# Altium schematic sheet SDRAM_32_BGA.SchDoc
size 420 x 297 mm; SheetNumber: 4; SheetTotal: 6; ListNumber: 2
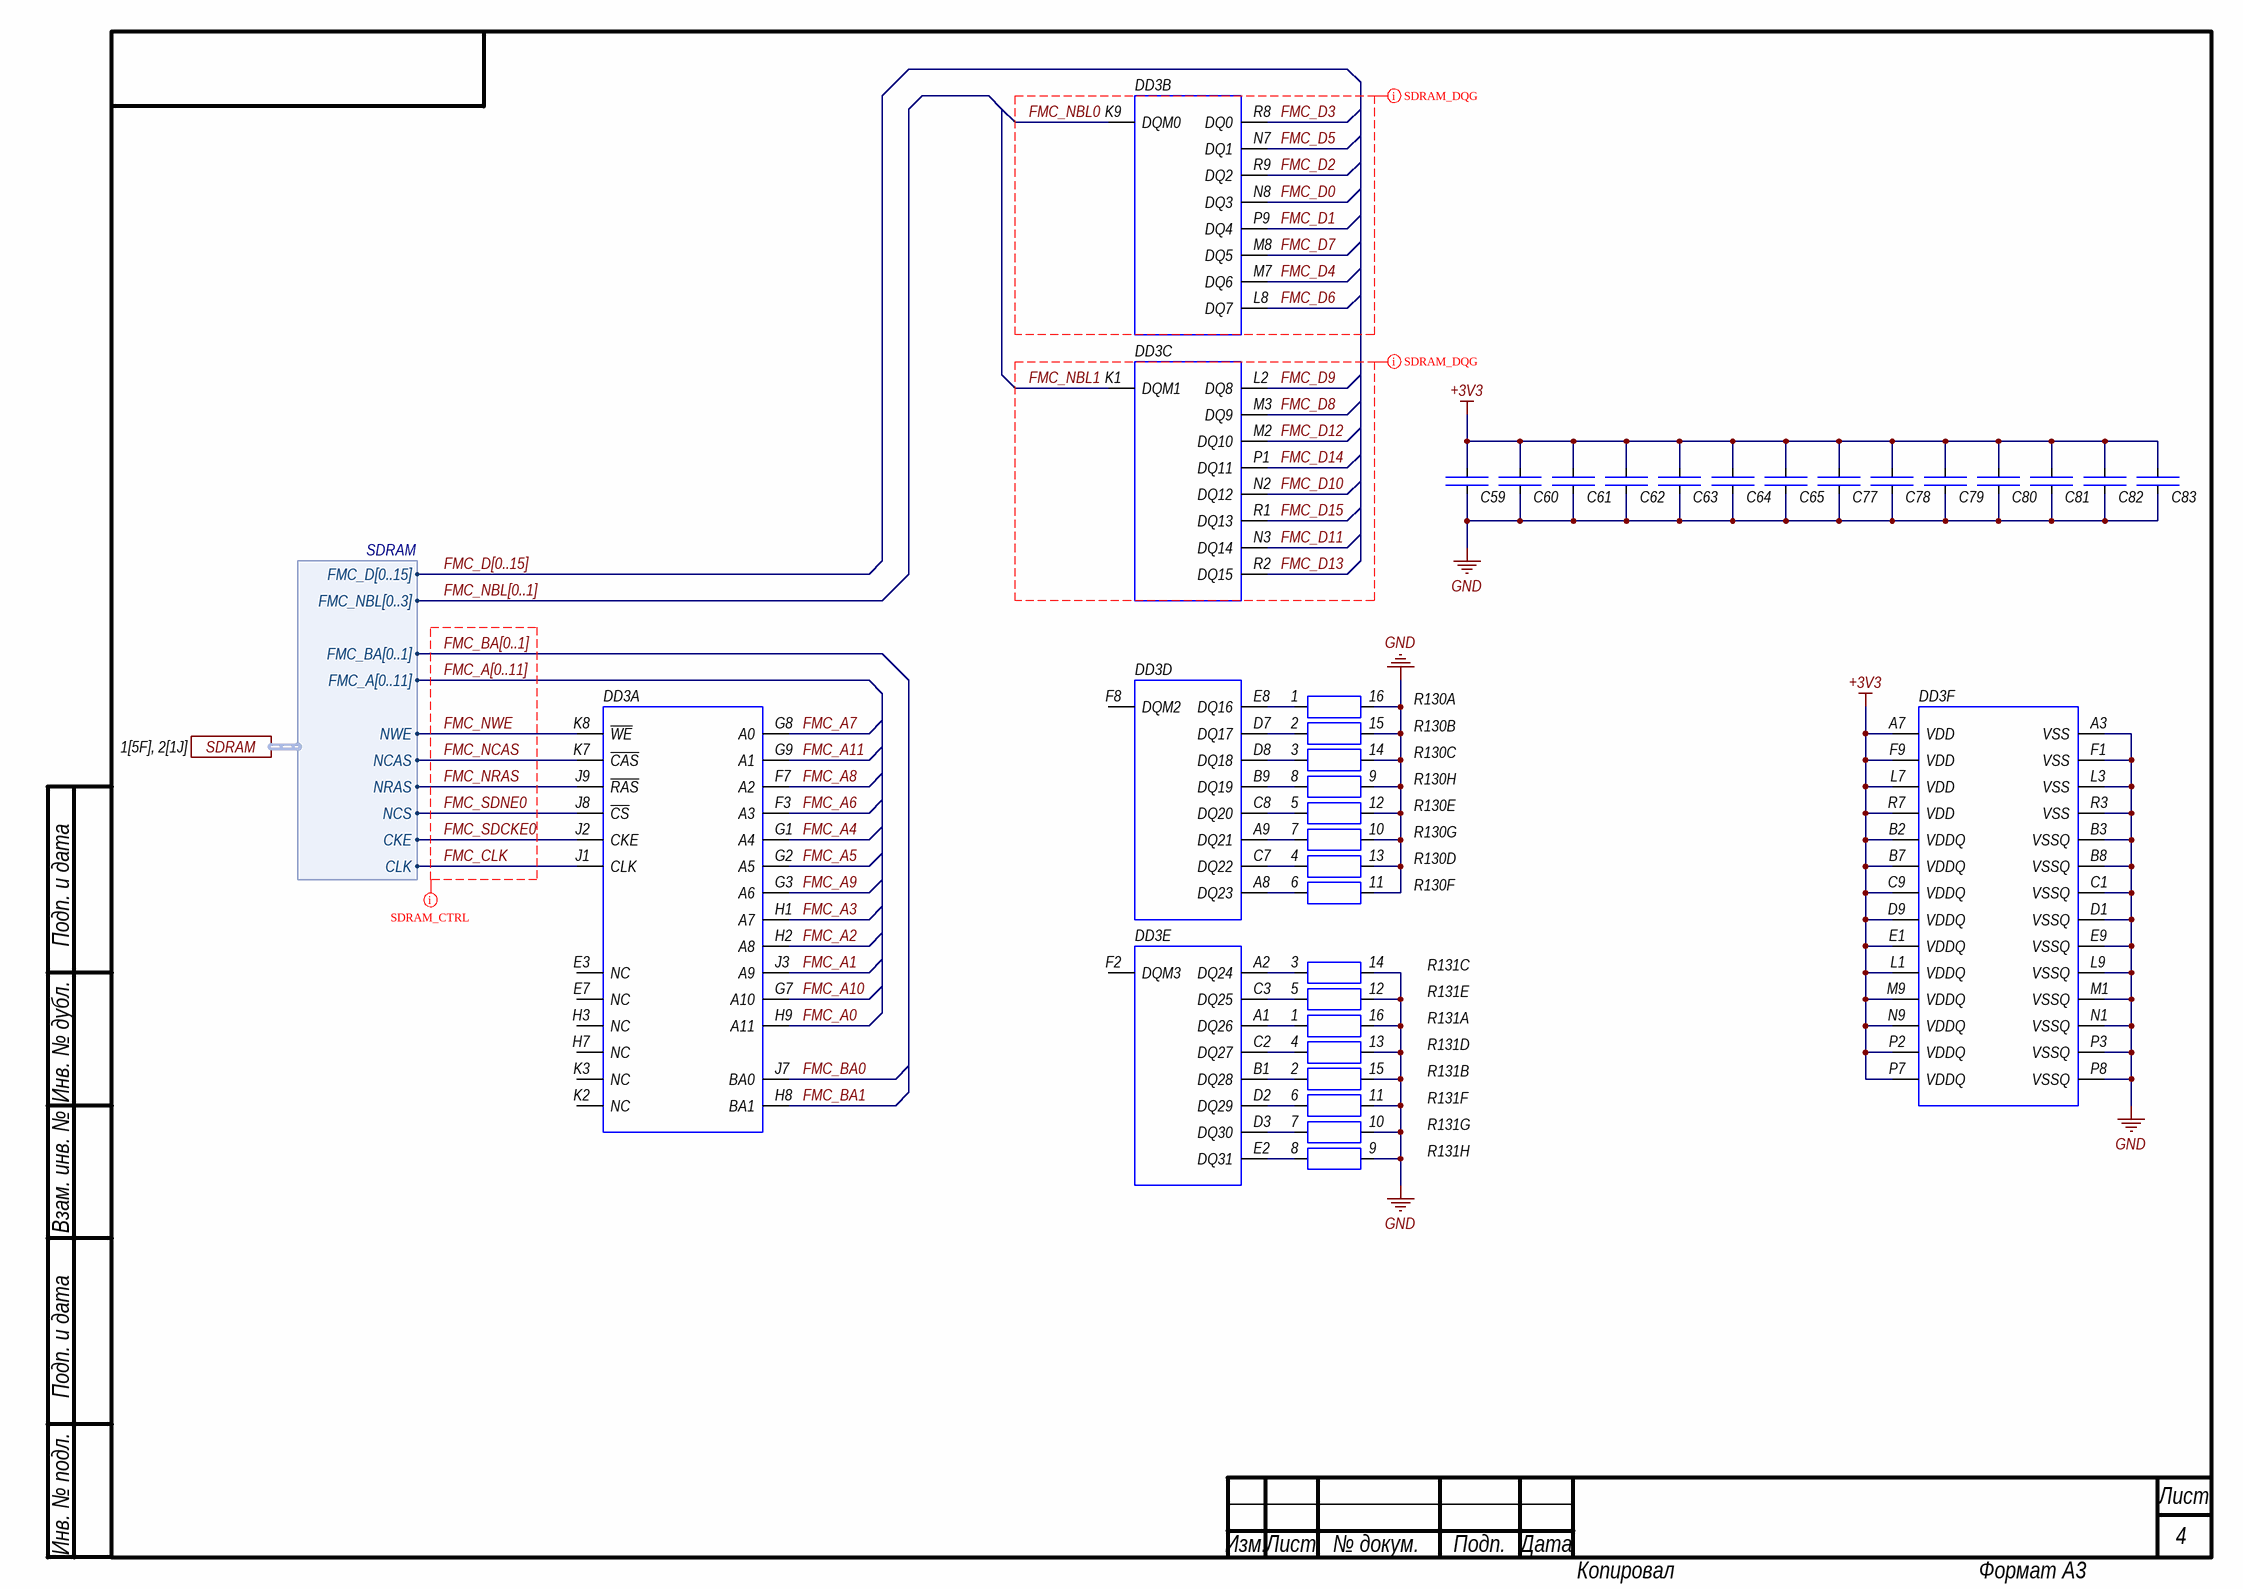
[diagram p0: SDRAM_32_BGA.SchDoc]

## Parts
C59  Конденсатор керам. ЧИП X5R, 10%, 0402, 0.1 мкФ  [Capacitor 0402]  (value not drawn)
C60  Конденсатор керам. ЧИП X5R, 10%, 0402, 0.1 мкФ  [Capacitor 0402]  (value not drawn)
C61  Конденсатор керам. ЧИП X5R, 10%, 0402, 0.1 мкФ  [Capacitor 0402]  (value not drawn)
C62  Конденсатор керам. ЧИП X5R, 10%, 0402, 0.1 мкФ  [Capacitor 0402]  (value not drawn)
C63  Конденсатор керам. ЧИП X5R, 10%, 0402, 0.1 мкФ  [Capacitor 0402]  (value not drawn)
C64  Конденсатор керам. ЧИП X5R, 10%, 0402, 0.1 мкФ  [Capacitor 0402]  (value not drawn)
C65  Конденсатор керам. ЧИП X5R, 10%, 0402, 0.1 мкФ  [Capacitor 0402]  (value not drawn)
C77  Конденсатор керам. ЧИП X5R, 10%, 0402, 0.1 мкФ  [Capacitor 0402]  (value not drawn)
C78  Конденсатор керам. ЧИП X5R, 10%, 0402, 0.1 мкФ  [Capacitor 0402]  (value not drawn)
C79  Конденсатор керам. ЧИП X5R, 10%, 0402, 0.1 мкФ  [Capacitor 0402]  (value not drawn)
C80  Конденсатор керам. ЧИП X5R, 10%, 0402, 0.1 мкФ  [Capacitor 0402]  (value not drawn)
C81  Конденсатор керам. ЧИП X5R, 10%, 0402, 0.1 мкФ  [Capacitor 0402]  (value not drawn)
C82  Конденсатор керам. ЧИП X5R, 10%, 0402, 0.1 мкФ  [Capacitor 0402]  (value not drawn)
C83  Конденсатор керам. ЧИП X5R, 10%, 0402, 0.1 мкФ  [Capacitor 0402]  (value not drawn)
DD3  Микросхема IS42S32400F-6BL  [BGA90C80P9X15_800X1300X120]  (value not drawn)  (parts A,B,C,D,E,F of 6)
R130  8-Resistor  [RESNET_1506-16_CONVEX]  (value not drawn)  (parts A,B,C,D,E,F,G,H of 8)
R131  8-Resistor  [RESNET_1506-16_CONVEX]  (value not drawn)  (parts A,B,C,D,E,F,G,H of 8)

## Ports
SDRAM (harness SDRAM, see 1[5F], 2[1J])

## Harnesses
SDRAM: FMC_D[0..15], NCAS, FMC_BA[0..1], NWE, FMC_A[0..11], NRAS, NCS, CLK, CKE, FMC_NBL[0..3]

## Nets
+3V3: C59.1 C60.1 C61.1 C62.1 C63.1 C64.1 C65.1 C77.1 C78.1 C79.1 C80.1 C81.1 C82.1 C83.1 DD3.A7(VDD) DD3.B2(VDDQ) DD3.B7(VDDQ) DD3.C9(VDDQ) DD3.D9(VDDQ) DD3.E1(VDDQ) DD3.F9(VDD) DD3.L1(VDDQ) DD3.L7(VDD) DD3.M9(VDDQ) DD3.N9(VDDQ) DD3.P2(VDDQ) DD3.P7(VDDQ) DD3.R7(VDD)
GND: C59.2 C60.2 C61.2 C62.2 C63.2 C64.2 C65.2 C77.2 C78.2 C79.2 C80.2 C81.2 C82.2 C83.2 DD3.A3(VSS) DD3.B3(VSSQ) DD3.B8(VSSQ) DD3.C1(VSSQ) DD3.D1(VSSQ) DD3.E9(VSSQ) DD3.F1(VSS) DD3.L3(VSS) DD3.L9(VSSQ) DD3.M1(VSSQ) DD3.N1(VSSQ) DD3.P3(VSSQ) DD3.P8(VSSQ) DD3.R3(VSS) R130.9 R130.10 R130.11 R130.12 R130.13 R130.14 R130.15 R130.16 R131.9 R131.10 R131.11 R131.12 R131.13 R131.14 R131.15 R131.16
FMC_A0: DD3.H9(A11)
FMC_A1: DD3.J3(A9)
FMC_A2: DD3.H2(A8)
FMC_A3: DD3.H1(A7)
FMC_A4: DD3.G1(A4)
FMC_A5: DD3.G2(A5)
FMC_A6: DD3.F3(A3)
FMC_A7: DD3.G8(A0)
FMC_A8: DD3.F7(A2)
FMC_A9: DD3.G3(A6)
FMC_A10: DD3.G7(A10)
FMC_A11: DD3.G9(A1)
FMC_BA0: DD3.J7(BA0)
FMC_BA1: DD3.H8(BA1)
FMC_CLK: DD3.J1(CLK) ; port SDRAM.CLK
FMC_D0: DD3.N8(DQ3)
FMC_D1: DD3.P9(DQ4)
FMC_D2: DD3.R9(DQ2)
FMC_D3: DD3.R8(DQ0)
FMC_D4: DD3.M7(DQ6)
FMC_D5: DD3.N7(DQ1)
FMC_D6: DD3.L8(DQ7)
FMC_D7: DD3.M8(DQ5)
FMC_D8: DD3.M3(DQ9)
FMC_D9: DD3.L2(DQ8)
FMC_D10: DD3.N2(DQ12)
FMC_D11: DD3.N3(DQ14)
FMC_D12: DD3.M2(DQ10)
FMC_D13: DD3.R2(DQ15)
FMC_D14: DD3.P1(DQ11)
FMC_D15: DD3.R1(DQ13)
FMC_NBL0: DD3.K9(DQM0)
FMC_NBL1: DD3.K1(DQM1)
FMC_NCAS: DD3.K7(~{CAS}) ; port SDRAM.NCAS
FMC_NRAS: DD3.J9(~{RAS}) ; port SDRAM.NRAS
FMC_NWE: DD3.K8(~{WE}) ; port SDRAM.NWE
FMC_SDCKE0: DD3.J2(CKE) ; port SDRAM.CKE
FMC_SDNE0: DD3.J8(~{CS}) ; port SDRAM.NCS
NetDD3_A1: DD3.A1(DQ26) R131.1
NetDD3_A2: DD3.A2(DQ24) R131.3
NetDD3_A8: DD3.A8(DQ23) R130.6
NetDD3_A9: DD3.A9(DQ21) R130.7
NetDD3_B1: DD3.B1(DQ28) R131.2
NetDD3_B9: DD3.B9(DQ19) R130.8
NetDD3_C2: DD3.C2(DQ27) R131.4
NetDD3_C3: DD3.C3(DQ25) R131.5
NetDD3_C7: DD3.C7(DQ22) R130.4
NetDD3_C8: DD3.C8(DQ20) R130.5
NetDD3_D2: DD3.D2(DQ29) R131.6
NetDD3_D3: DD3.D3(DQ30) R131.7
NetDD3_D7: DD3.D7(DQ17) R130.2
NetDD3_D8: DD3.D8(DQ18) R130.3
NetDD3_E2: DD3.E2(DQ31) R131.8
NetDD3_E8: DD3.E8(DQ16) R130.1

Not connected (* = marked no-connect by the designer): DD3 E3(NC) E7(NC) F2(DQM3) F8(DQM2) H3(NC) H7(NC) K2(NC) K3(NC)

## Buses and harness runs
bus FMC_A[0..11]
bus FMC_BA[0..1]
bus FMC_D[0..15]
bus FMC_NBL[0..1]

## Layout directives
net class SDRAM_CTRL; rule Matched Net Lengths [Delay Tolerance = 200ps]: FMC_A[0..11], FMC_BA[0..1], FMC_CLK, FMC_NCAS, FMC_NRAS, FMC_NWE, FMC_SDCKE0, FMC_SDNE0
net class SDRAM_DQM0; rule Matched Net Lengths [Delay Tolerance = 100ps]: FMC_D0, FMC_D1, FMC_D2, FMC_D3, FMC_D4, FMC_D5, FMC_D6, FMC_D7, FMC_NBL0
net class SDRAM_DQM1; rule Matched Net Lengths [Delay Tolerance = 100ps]: FMC_D8, FMC_D9, FMC_D10, FMC_D11, FMC_D12, FMC_D13, FMC_D14, FMC_D15, FMC_NBL1

## Notes on the sheet
- Подп. и дата
- Инв. № дубл.
- Взам. инв. №
- Инв. № подл.
- Изм.
- Лист
- № докум.
- Подп.
- Дата
- Копировал
- Формат А3

## Library data of the parts
C59-C65 C77-C83 = 000821-3: Cap Ceramic 0.1uF 50V X5R 10% Pad SMD 0402 85C T/R; Manufacturer: Murata Manufacturing; Manufacturer Part Number: GRM155R61H104KE14J; Device: 100nFx50V; Capacitance: 100nF; PCAD Reader Code: 0; Info: 100nFx50V; Voltage: 50V; Case: 0402; Pin Count: 2; Help URL: https://www.digikey.com/en/products/detail/murata-electronics/GRM155R61H104KE14J/4905153; Storage Code: 0; Dielectric: X5R; Tolerance: 10%
DD3 = IS42S32400F-6BL: 128Mb (4M x 32) Synchronous DRAM; Part Number: IS42S32400F-6BL; Device: IS42S32400F-6BL; Info: IS42S32400F-6BL; Case: 90-Ball TF-BGA; Manufacturer Part Number: IS42S32400F-6BL; Pin Count: 90
R130 R131 = EXB2HV103JV: Manufacturer: Panasonic; Device: 10k; Part Number: EXB2HV103JV; Info: 10k; Resistance: 10k; Case: SMD-1506; Manufacturer Part Number: EXB2HV103JV; Pin Count: 16